# Altium schematic sheet UV Sensor.SchDoc: UV Sensor
size 292 x 193 mm; SheetNumber: 4; SheetTotal: 5
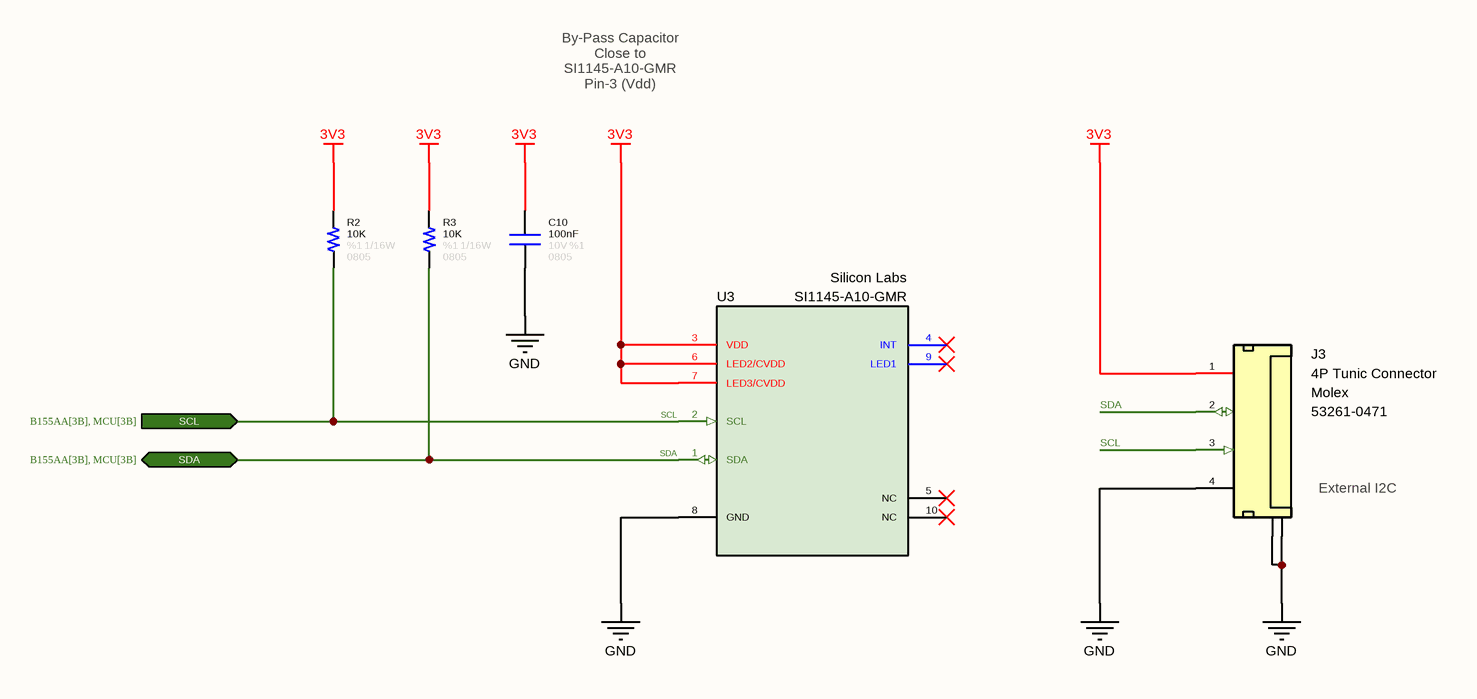
[diagram p0: UV Sensor.SchDoc]

## Parts
C10  value 100nF  Tolerance: %1  Voltage: 10V  Case: 0805  [CAPACITOR_0805]  (hidden comment: Capacitor - 100nF [0805] (MLCC))
J3  Manufacturer Name: Molex  Manufacturer Part Number: 53261-0471  [Connector_Tunic 4P]  (hidden comment: 4P SMD Tunic Connector)
R2  value 10K  Tolerance: %1  Case: 0805  Power: 1/16W  [RESISTOR_0805]  (hidden comment: 10K - 0805 - %1 - 1/16W)
R3  value 10K  Tolerance: %1  Case: 0805  Power: 1/16W  [RESISTOR_0805]  (hidden comment: 10K - 0805 - %1 - 1/16W)
U3  Manufacturer Name: Silicon Labs  [SI1145]  (hidden comment: Si1145-A10-GMR)

## Ports
SCL (in, see B155AA[3B], MCU[3B]), SDA (bidir, see B155AA[3B], MCU[3B])

## Nets
3V3: C10.2 J3.1(3V3) R2.2 R3.2 U3.3(VDD) U3.6(LED2/CVDD) U3.7(LED3/CVDD)
GND: C10.1 J3.4(GND) J3.5(GND) J3.6(GND) U3.8(GND)
SCL: J3.3(SCL) R2.1 U3.2(SCL) ; port SCL
SDA: J3.2(SDA) R3.1 U3.1(SDA) ; port SDA

Not connected (* = marked no-connect by the designer): U3 4(INT)* 5(NC)* 9(LED1)* 10(NC)*

## Notes on the sheet
- By-Pass Capacitor
  Close to SI1145-A10-GMR
  Pin-3 (Vdd)
- (near J3) External I2C
- © 2022 All rights reserved.
  This document may not, in whole or in part, be copied, photocopied, reproduced, translated or converted to any electronic or machine readable from without prior written permission of Mehmet Günce Akkoyun.
  Engineer contact : akkoyun@me.com
- Property of
- Engineer :
- Date :
- Size :
- A4
- Time :
- Project :
- Page :
- /
- Customer :
- Product ID :
- Module ID :
- Version :
- File :
- Revision :
- (in symbol Connector - Mini Tunic 4P (1.25)) 4P Tunic Connector

## Library data of the parts
C10 = Capacitor - 100nF [0805-10V]: Capacitor (MLCC) - 100nF / 10V / 0805; Manufacturer Name: KEMET; Manufacturer Part Number: C0805C104K8JACAUTO; Subcategory: Capacitors
J3 = Connector - Mini Tunic 4P (1.25): Mini Tunic Connector with 4P; Pitch: 1.25mm; Position: 4; ROHS: Yes; ComponentLink1Description: DataSheet; ComponentLink1URL: https://www.mouser.com.tr/datasheet/2/276/0532610471_PCB_HEADERS-170942.pdf; ComponentLink2Description: Mouser; ComponentLink2URL: https://www.mouser.com.tr/ProductDetail/Molex/53261-0471?qs=%2Fha2pyFaduhLhIsk8tywtK7BwWtguBSP4XxyDBTOTfs%3D; Case: SMD
R2 R3 = Resistor - 10K [0805]: Thick Film Resistors - SMD 1/16 W 10 KOhm 1%; Manufacturer Name: Vishay; Manufacturer Part Number: CRCW040210K0FKED; ComponentLink1Description: DataSheet; ComponentLink1URL: https://www.mouser.com.tr/datasheet/2/427/dcrcwe3-1762152.pdf; ComponentLink2Description: Mouser; ComponentLink2URL: https://www.mouser.com.tr/ProductDetail/Vishay-Dale/CRCW040210K0FKED?qs=sGAEpiMZZMu61qfTUdNhG2DpbjADlD3GcalbOv9utCY%3D
U3 = IC - Si1145-A10-GMR: Proximity Sensors I2C UV Index and Proximity/Ambient Light Sensor with 1 LED Driver; Case: QFN-10; RoHS: Yes; Manufacturer Part Number: SI1145-A10-GMR